# Altium project MB1297 revC.PrjPcb (part 2 of 2)

## Sheet MB1297_POWER.SchDoc: POWER SUPPLY
size A4; DocumentNumber: MB1297; Revision: C; SheetNumber: 8; SheetTotal: 11
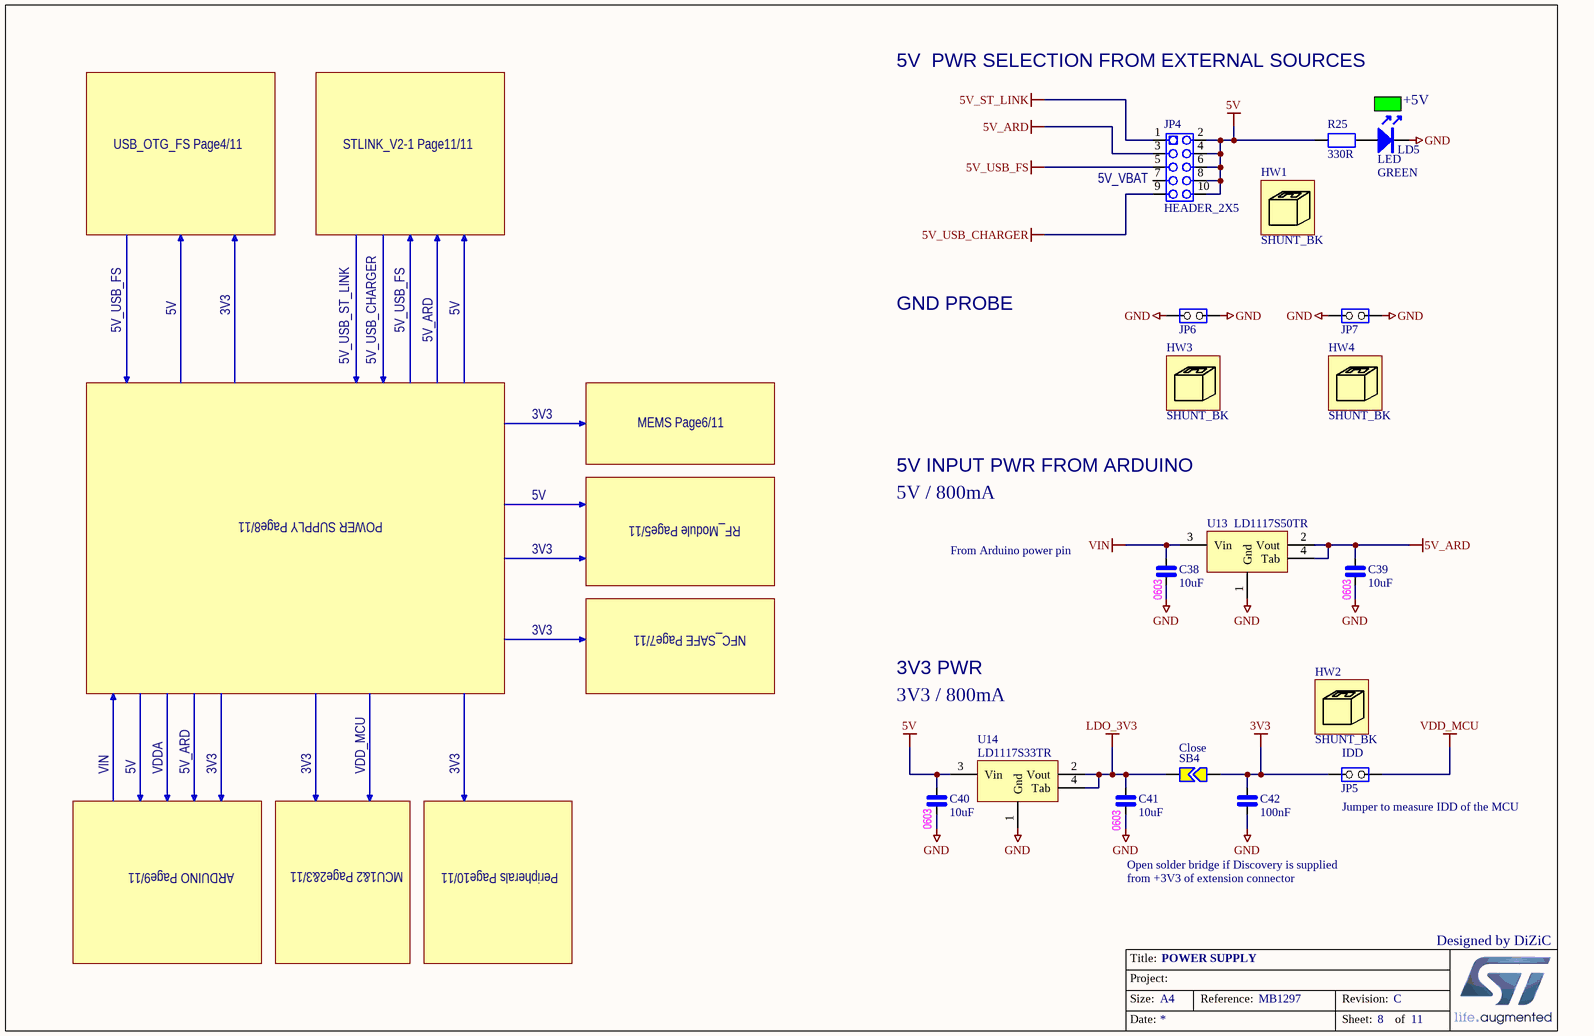
[diagram p10: MB1297_POWER.SchDoc]

### Parts
C38  10uF  [0603_CAP_NPOL]
C39  10uF  [0603_CAP_NPOL]
C40  10uF  [0603_CAP_NPOL]
C41  10uF  [0603_CAP_NPOL]
C42  100nF  [0402_CAP_NPOL]
HW1  SHUNT_BK  (mechanical)
HW2  SHUNT_BK  (mechanical)
HW3  SHUNT_BK  (mechanical)
HW4  SHUNT_BK  (mechanical)
JP4  HEADER_2X5  [Header M 2x5x2.54 TH V]
JP5  Jumper_2.54mm  [CON_SAMTEC_TSW-102-07-G-S]  (value not drawn)
JP6  Jumper_2.54mm  [CON_SAMTEC_TSW-102-07-G-S]  (value not drawn)
JP7  Jumper_2.54mm  [CON_SAMTEC_TSW-102-07-G-S]  (value not drawn)
LD5  LED  Color: GREEN  [0603_LED_GREEN]
R25  330R  [0402_RES]
SB4  Close  [SB]
U13  LD1117S50TR  [REG_SOT223-TAB]
U14  LD1117S33TR  [REG_SOT223-TAB]

### Nets
3V3: C42.1 JP5.1(COMMON) SB4.2
5V: C40.1 JP4.2 JP4.4 JP4.6 JP4.8 JP4.10 R25.1 U14.3(Vin)
5V_ARD: C39.1 JP4.3 U13.2(Vout) U13.4(Tab)
5V_ST_LINK: JP4.1
5V_USB_CHARGER: JP4.9
5V_USB_FS: JP4.5
GND: C38.2 C39.2 C40.2 C41.2 C42.2 JP6.1(COMMON) JP6.2(NO) JP7.1(COMMON) JP7.2(NO) LD5.K U13.1(Gnd) U14.1(Gnd)
LDO_3V3: C41.1 SB4.1 U14.2(Vout) U14.4(Tab)
VDD_MCU: JP5.2(NO)
VIN: C38.1 U13.3(Vin)
NetLD5_A: LD5.A R25.2

Not connected (* = marked no-connect by the designer): JP4 7

### Notes on the sheet
- 5V  PWR SELECTION FROM EXTERNAL SOURCES
- (near LD5) +5V
- USB_OTG_FS Page4/11
- STLINK_V2-1 Page11/11
- (near JP4) 5V_VBAT
- 5V
- 3V3
- GND PROBE
- 5V_USB_FS
- 5V_USB_ST_LINK
- 5V_USB_CHARGER
- 5V_ARD
- MEMS Page6/11
- POWER SUPPLY Page8/11
- RF_Module Page5/11
- 5V / 800mA
- 5V INPUT PWR FROM ARDUINO
- From Arduino power pin
- NFC_SAFE Page7/11
- (near C38) 0603
- (near C39) 0603
- 3V3 / 800mA
- 3V3 PWR
- VIN
- VDDA
- VDD_MCU
- (near JP5) IDD
- (near C40) 0603
- (near C41) 0603
- (near JP5) Jumper to measure IDD of the MCU
- ARDUINO Page9/11
- MCU1&2 Page2&3/11
- Peripherals Page10/11
- Open solder bridge if Discovery is supplied
  from +3V3 of extension connector
- Designed by DiZiC
- Title:
- Project:
- Size:
- Date:
- A4
- Reference:
- Sheet:
- Revision:
- of

### Library data of the parts
C38-C42 = CAP_NPOL: Capacitor_not polarized
HW1-HW4 = Shunt 2.54mm: SHUNT 2.54mm BLACK; Manuf_1: SAMTEC; Manuf_Part_1: SNT-100-BK-G; Fitted: Manually; Ordered_By: Subcon; ECCN_US/EU: n/a; Distrib: *; Order_Code: *; Value: SHUNT_BK
JP5-JP7 = TSW-102-07-x-S: Connector jumper 1 position; Manuf_1: SAMTEC; Manuf_Part_2: 4711955140470; Manuf_2: KONTEC; Order_Code: 423-2841; Fitted: YES; Ordered_By: Subcon; ECCN_US/EU: n/a; Value: Jumper_2.54mm; Manuf_Part_1: TSW-102-07-x-S
LD5 = LED: Light-Emitting Diode; Part Number A: *
R25 = RES: Resistor
SB4 = Strap2: Solder Jumper; Solder: YES; Published: 24-Mar-1999; Revision: July-2002: Re-released for DXP Platform.; Publisher: Altium Limited
U13 = LD1117S50TR: IC REG LDO 5V 0.8A SOT223; Manuf_1: STM; ECCN_US/EU: EAR99/NEC; Ref St: 9176133; Fitted: YES; Manuf_Part_1: LD1117S50TR; Distrib: STM; Ordered_By: STM; Order_code: LD1117S50TR; Value: LD1117S50TR
U14 = LD1117S33TR: LOW DROP FIXED AND ADJUSTABLE POSITIVE VOLTAGE REGULATORS (3.3 Volts); Manuf_1: STM; ECCN_US/EU: EAR99/NEC; Fitted: YES; Manuf_Part_1: LD1117S33TR; Distrib: STM; Order_Code: LD1117S33TR; Ordered_By: STM; Value: LD1117S33TR

## Nets that join several sheets
3V3: MB1297_MCU1 (R8.1 R9.1 R10.1 R11.1), MB1297_RF_Module (7 pins), MB1297_Peripherals (6 pins), MB1297_NFC_SAFE (C33.1 L2.2 R4.1 U9.2), MB1297_Arduino (CN2.2 CN2.4), MB1297_MEMS (37 pins), MB1297_USB_OTG_FS (LD8.A LD9.A R58.1 R62.1), MB1297_POWER (C42.1 JP5.1 SB4.2)
5V: MB1297_RF_Module (C49.1 U12.1), MB1297_STLINK_V2-1 (D2.1), MB1297_Arduino (CN2.5), MB1297_USB_OTG_FS (U19.5), MB1297_POWER (8 pins)
5V_ARD: MB1297_STLINK_V2-1 (D3.1), MB1297_Arduino (R3.1), MB1297_POWER (C39.1 JP4.3 U13.2 U13.4)
5V_ST_LINK: MB1297_STLINK_V2-1 (C65.1 SB11.1 U17.6 U17.7), MB1297_POWER (JP4.1)
5V_USB_CHARGER: MB1297_STLINK_V2-1 (11 pins), MB1297_POWER (JP4.9)
5V_USB_FS: MB1297_STLINK_V2-1 (D5.1), MB1297_USB_OTG_FS (R61.1), MB1297_POWER (JP4.5)
GND: MB1297_MCU1 (C14.2 C15.2), MB1297_MCU2 (20 pins), MB1297_RF_Module (29 pins), MB1297_Peripherals (14 pins), MB1297_NFC_SAFE (11 pins), MB1297_STLINK_V2-1 (42 pins), MB1297_Arduino (C1.2 CN1.7 CN2.6 CN2.7), MB1297_MEMS (36 pins), MB1297_USB_OTG_FS (11 pins), MB1297_POWER (12 pins)
VDD_MCU: MB1297_MCU2 (15 pins), MB1297_POWER (JP5.2)
VDDA: MB1297_MCU2 (5 pins), MB1297_Arduino (C1.1 R2.2)
VIN: MB1297_Arduino (CN2.8), MB1297_POWER (C38.1 U13.3)
NetC3_2: MB1297_MCU2 (C3.2 U1.14), MB1297_Peripherals (SB2.1), MB1297_Arduino (CN2.3)
NetC66_1: MB1297_MCU1 (U1.68), MB1297_USB_OTG_FS (6 pins)
NetCN1_1: MB1297_MCU1 (U1.37), MB1297_Arduino (CN1.1)
NetCN1_2: MB1297_MCU1 (U1.77), MB1297_Arduino (CN1.2)
NetCN1_3: MB1297_MCU1 (U1.25), MB1297_Arduino (CN1.3)
NetCN1_4: MB1297_MCU1 (U1.32), MB1297_Arduino (CN1.4)
NetCN1_5: MB1297_MCU1 (U1.31), MB1297_Arduino (CN1.5)
NetCN1_6: MB1297_MCU1 (U1.30), MB1297_Peripherals (SB1.1), MB1297_Arduino (CN1.6)
NetCN1_9: MB1297_MCU1 (R8.2 U1.96), MB1297_Arduino (CN1.9)
NetCN1_10: MB1297_MCU1 (R9.2 U1.95), MB1297_Arduino (CN1.10)
NetCN3_1: MB1297_MCU1 (U1.24), MB1297_Arduino (CN3.1)
NetCN3_2: MB1297_MCU1 (U1.23), MB1297_Arduino (CN3.2)
NetCN3_3: MB1297_MCU1 (U1.61), MB1297_Arduino (CN3.3)
NetCN3_4: MB1297_MCU1 (U1.35), MB1297_Arduino (CN3.4)
NetCN3_5: MB1297_MCU1 (U1.26), MB1297_Arduino (CN3.5)
NetCN3_6: MB1297_MCU1 (U1.90), MB1297_Arduino (CN3.6)
NetCN3_7: MB1297_MCU1 (U1.36), MB1297_Arduino (CN3.7)
NetCN3_8: MB1297_MCU1 (U1.29), MB1297_Arduino (CN3.8)
NetCN4_1: MB1297_MCU1 (U1.34), MB1297_Arduino (CN4.1)
NetCN4_2: MB1297_MCU1 (U1.33), MB1297_Arduino (CN4.2)
NetCN4_3: MB1297_MCU1 (U1.18), MB1297_Arduino (CN4.3)
NetCN4_4: MB1297_MCU1 (U1.17), MB1297_Arduino (CN4.4)
NetCN4_5: MB1297_MCU1 (U1.16), MB1297_Arduino (CN4.5)
NetCN4_6: MB1297_MCU1 (U1.15), MB1297_Arduino (CN4.6)
NetCN9_4: MB1297_MCU1 (U1.69), MB1297_USB_OTG_FS (CN9.4 U20.A3)
NetCN10_7: MB1297_MCU1 (U1.83), MB1297_Peripherals (CN10.7)
NetCN10_8: MB1297_MCU1 (U1.81), MB1297_Peripherals (CN10.8)
NetM1_4: MB1297_MCU1 (U1.5), MB1297_RF_Module (M1.4)
NetM1_7: MB1297_MCU1 (U1.78), MB1297_RF_Module (M1.7 M2.11 M3.7)
NetM1_8: MB1297_MCU1 (U1.79), MB1297_RF_Module (M1.8 M2.10 M3.8)
NetM1_9: MB1297_MCU1 (U1.80), MB1297_RF_Module (M1.9 M2.9 M3.9)
NetM1_10: MB1297_MCU1 (U1.60), MB1297_RF_Module (M1.10)
NetM1_11: MB1297_MCU1 (U1.67), MB1297_RF_Module (M1.11)
NetM2_12: MB1297_MCU1 (U1.97), MB1297_RF_Module (M2.12 R26.1)
NetM2_13: MB1297_MCU1 (U1.98), MB1297_RF_Module (M2.13)
NetM2_16: MB1297_MCU1 (U1.52), MB1297_RF_Module (M2.16)
NetM2_21: MB1297_MCU1 (U1.55), MB1297_RF_Module (M2.21)
NetM2_22: MB1297_MCU1 (U1.56), MB1297_RF_Module (M2.22)
NetM2_33: MB1297_MCU1 (U1.51), MB1297_RF_Module (M2.33)
NetM2_34: MB1297_MCU1 (U1.39), MB1297_RF_Module (M2.34)
NetM3_1: MB1297_MCU1 (U1.4), MB1297_RF_Module (M3.1)
NetM3_10: MB1297_MCU1 (U1.91), MB1297_RF_Module (M3.10)
NetM3_11: MB1297_MCU1 (U1.54), MB1297_RF_Module (M3.11)
NetR1_2: MB1297_MCU1 (U1.1), MB1297_NFC_SAFE (R1.2 U8.1)
NetR4_2: MB1297_MCU1 (U1.3), MB1297_NFC_SAFE (R4.2 U8.7)
NetR6_2: MB1297_MCU1 (U1.40), MB1297_MEMS (R6.2)
NetR10_2: MB1297_MCU1 (R10.2 U1.47), MB1297_NFC_SAFE (U8.6 U9.7), MB1297_MEMS (5 pins)
NetR11_2: MB1297_MCU1 (R11.2 U1.48), MB1297_NFC_SAFE (U8.5 U9.5), MB1297_MEMS (5 pins)
NetR13_2: MB1297_MCU1 (U1.38), MB1297_MEMS (R13.2)
NetR14_2: MB1297_MCU1 (U1.64), MB1297_MEMS (R14.2 U4.7)
NetR15_2: MB1297_MCU1 (U1.63), MB1297_MEMS (R15.2 U4.5)
NetR20_1: MB1297_MCU1 (U1.53), MB1297_Peripherals (R20.1)
NetR21_1: MB1297_MCU1 (U1.66), MB1297_Peripherals (R21.1 R22.1)
NetR32_2: MB1297_MCU1 (U1.76), MB1297_STLINK_V2-1 (R32.2 SB6.1)
NetR33_2: MB1297_MCU1 (U1.72), MB1297_STLINK_V2-1 (R33.2 SB5.1)
NetR35_2: MB1297_MCU1 (U1.89), MB1297_STLINK_V2-1 (R35.2 SB7.1)
NetR42_2: MB1297_MCU1 (U1.93), MB1297_STLINK_V2-1 (R42.2)
NetR43_2: MB1297_MCU1 (U1.92), MB1297_STLINK_V2-1 (R43.2)
NetR56_1: MB1297_MCU1 (U1.2), MB1297_USB_OTG_FS (R56.1 R58.2 U19.3)
NetR62_2: MB1297_MCU1 (U1.59), MB1297_USB_OTG_FS (R62.2 U19.4)
NetSB3_1: MB1297_MCU1 (U1.7), MB1297_Peripherals (SB3.1)
NetSB12_2: MB1297_MCU1 (U1.86), MB1297_Peripherals (SB12.2 SB14.2)
NetSB15_2: MB1297_MCU1 (U1.85), MB1297_Peripherals (SB15.2 SB16.2)
NetSB18_2: MB1297_MCU1 (U1.84), MB1297_Peripherals (SB18.2 SB19.2)
NetSB20_1: MB1297_MCU1 (U1.87), MB1297_Peripherals (SB20.1)
NetSB21_1: MB1297_MCU1 (U1.82), MB1297_Peripherals (SB21.1)
NetU1_41: MB1297_MCU1 (U1.41), MB1297_RF_Module (U11.6)
NetU1_42: MB1297_MCU1 (U1.42), MB1297_RF_Module (U11.1)
NetU1_43: MB1297_MCU1 (U1.43), MB1297_RF_Module (U11.5)
NetU1_44: MB1297_MCU1 (U1.44), MB1297_RF_Module (U11.2)
NetU1_45: MB1297_MCU1 (U1.45), MB1297_RF_Module (U11.3)
NetU1_46: MB1297_MCU1 (U1.46), MB1297_RF_Module (U11.7)
NetU1_57: MB1297_MCU1 (U1.57), MB1297_MEMS (U7.7)
NetU1_58: MB1297_MCU1 (U1.58), MB1297_MEMS (U3.4)
NetU1_62: MB1297_MCU1 (U1.62), MB1297_MEMS (U6.3)
NetU1_65: MB1297_MCU1 (U1.65), MB1297_MEMS (U5.8)
NetU1_88: MB1297_MCU1 (U1.88), MB1297_NFC_SAFE (U9.1)
USB_N: MB1297_MCU1 (U1.70), MB1297_USB_OTG_FS (CN9.2 U20.D1 U20.D3)
USB_P: MB1297_MCU1 (U1.71), MB1297_USB_OTG_FS (CN9.3 U20.C1 U20.C3)